# EAGLE design NailUV 2x5x3 (EAGLE 8.1.1)
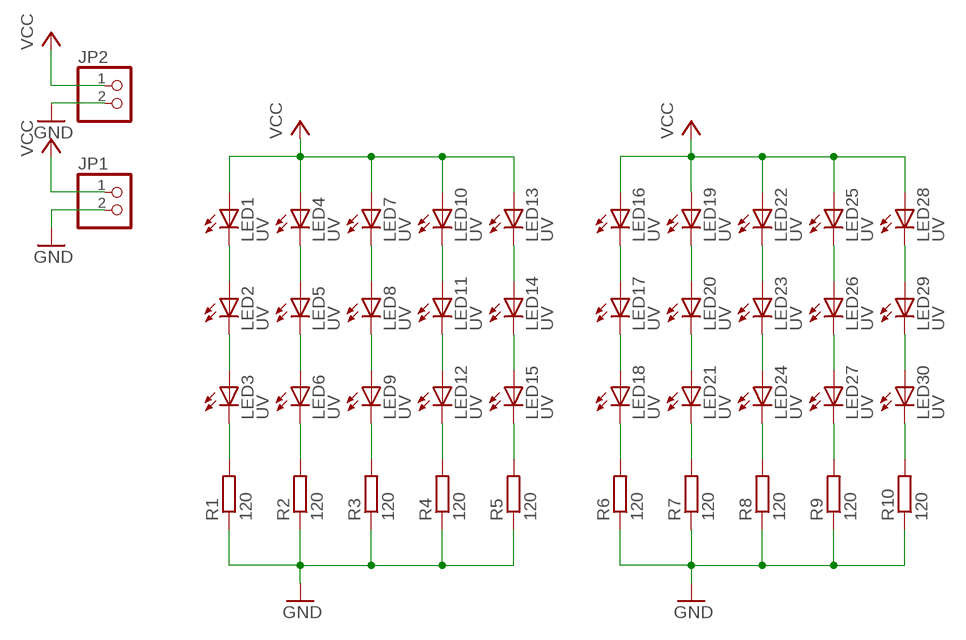
[diagram p0: schematic, sheet 1]

## Parts
JP1  PINHD-1X2  [1X02]
JP2  PINHD-1X2  [1X02]
LED1  UV  LED5MM  [LED5MM]
LED2  UV  LED5MM  [LED5MM]
LED3  UV  LED5MM  [LED5MM]
LED4  UV  LED5MM  [LED5MM]
LED5  UV  LED5MM  [LED5MM]
LED6  UV  LED5MM  [LED5MM]
LED7  UV  LED5MM  [LED5MM]
LED8  UV  LED5MM  [LED5MM]
LED9  UV  LED5MM  [LED5MM]
LED10  UV  LED5MM  [LED5MM]
LED11  UV  LED5MM  [LED5MM]
LED12  UV  LED5MM  [LED5MM]
LED13  UV  LED5MM  [LED5MM]
LED14  UV  LED5MM  [LED5MM]
LED15  UV  LED5MM  [LED5MM]
LED16  UV  LED5MM  [LED5MM]
LED17  UV  LED5MM  [LED5MM]
LED18  UV  LED5MM  [LED5MM]
LED19  UV  LED5MM  [LED5MM]
LED20  UV  LED5MM  [LED5MM]
LED21  UV  LED5MM  [LED5MM]
LED22  UV  LED5MM  [LED5MM]
LED23  UV  LED5MM  [LED5MM]
LED24  UV  LED5MM  [LED5MM]
LED25  UV  LED5MM  [LED5MM]
LED26  UV  LED5MM  [LED5MM]
LED27  UV  LED5MM  [LED5MM]
LED28  UV  LED5MM  [LED5MM]
LED29  UV  LED5MM  [LED5MM]
LED30  UV  LED5MM  [LED5MM]
R1  120  R-EU_0207/10  [0207/10]
R2  120  R-EU_0207/10  [0207/10]
R3  120  R-EU_0207/10  [0207/10]
R4  120  R-EU_0207/10  [0207/10]
R5  120  R-EU_0207/10  [0207/10]
R6  120  R-EU_0207/10  [0207/10]
R7  120  R-EU_0207/10  [0207/10]
R8  120  R-EU_0207/10  [0207/10]
R9  120  R-EU_0207/10  [0207/10]
R10  120  R-EU_0207/10  [0207/10]

## Nets
GND: JP1.2 JP2.2 R1.1 R2.1 R3.1 R4.1 R5.1 R6.1 R7.1 R8.1 R9.1 R10.1
N$1: LED1.K(C) LED2.A
N$2: LED4.K(C) LED5.A
N$3: LED7.K(C) LED8.A
N$4: LED2.K(C) LED3.A
N$5: LED5.K(C) LED6.A
N$6: LED8.K(C) LED9.A
N$7: LED3.K(C) R1.2
N$8: LED6.K(C) R2.2
N$9: LED9.K(C) R3.2
N$10: LED13.K(C) LED14.A
N$11: LED10.K(C) LED11.A
N$12: LED11.K(C) LED12.A
N$13: LED14.K(C) LED15.A
N$14: LED15.K(C) R5.2
N$15: LED12.K(C) R4.2
N$16: LED16.K(C) LED17.A
N$17: LED19.K(C) LED20.A
N$18: LED22.K(C) LED23.A
N$19: LED17.K(C) LED18.A
N$20: LED20.K(C) LED21.A
N$21: LED23.K(C) LED24.A
N$22: LED18.K(C) R6.2
N$23: LED21.K(C) R7.2
N$24: LED24.K(C) R8.2
N$25: LED28.K(C) LED29.A
N$26: LED25.K(C) LED26.A
N$27: LED26.K(C) LED27.A
N$28: LED29.K(C) LED30.A
N$29: LED30.K(C) R10.2
N$30: LED27.K(C) R9.2
VCC: JP1.1 JP2.1 LED1.A LED4.A LED7.A LED10.A LED13.A LED16.A LED19.A LED22.A LED25.A LED28.A

## Library data of the parts
JP1 JP2 = pinhead:PINHD-1X2: PIN HEADER
LED1-LED30 = led:LED: LED OSRAM: - CHIPLED LG R971, LG N971, LY N971, LG Q971, LY Q971, LO R971, LY R971 LH N974, LH R974 LS Q976, LO Q976, LY Q976 LO Q996 - Hyper CHIPLED LW Q18S LB Q993, LB Q99A, LB R99A - SideLED LS A670, LO A670, LY A670, LG A670, LP A670 LB A673, LV A673, LT A673, LW A673 LH A674 LY A675 LS A676, LA A676, LO A676, LY A676, LW A676 LS A679, LY A679, LG A679 - Hyper Micro SIDELED® LS Y876, LA Y876, LO Y876, LY Y876 LT Y87S - SmartLED LW L88C, LW L88S LB L89C, LB L89S, LG L890 LS L89K, LO L89K, LY L89K LS L896, LA L896, LO L896, LY L896 - TOPLED LS T670, LO T670, LY T670, LG T670, LP T670 LSG T670, LSP T670, LSY T670, LOP T670, LYG T670 LG T671, LOG T671, LSG T671 LB T673, LV T673, LT T673, LW T673 LH T674 LS T676, LA T676, LO T676, LY T676, LB T676, LH T676, LSB T676, LW T676 LB T67C, LV T67C, LT T67C, LS T67K, LO T67K, LY T67K, LW E67C LS E67B, LA E67B, LO E67B, LY E67B, LB E67C, LV E67C, LT E67C LW T67C LS T679, LY T679, LG T679 LS T770, LO T770, LY T770, LG T770, LP T770 LB T773, LV T773, LT T773, LW T773 LH T774 LS E675, LA E675, LY E675, LS T675 LS T776, LA T776, LO T776, LY T776, LB T776 LHGB T686 LT T68C, LB T68C - Hyper Mini TOPLED® LB M676 - Mini TOPLED Santana® LG M470 LS M47K, LO M47K, LY M47K Source: http://www.osram.convergy.de LUXEON: - LUMILED® LXK2-PW12-R00, LXK2-PW12-S00, LXK2-PW14-U00, LXK2-PW14-V00 LXK2-PM12-R00, LXK2-PM12-S00, LXK2-PM14-U00 LXK2-PE12-Q00, LXK2-PE12-R00, LXK2-PE12-S00, LXK2-PE14-T00, LXK2-PE14-U00 LXK2-PB12-K00, LXK2-PB12-L00, LXK2-PB12-M00, LXK2-PB14-N00, LXK2-PB14-P00, LXK2-PB14-Q00 LXK2-PR12-L00, LXK2-PR12-M00, LXK2-PR14-Q00, LXK2-PR14-R00 LXK2-PD12-Q00, LXK2-PD12-R00, LXK2-PD12-S00 LXK2-PH12-R00, LXK2-PH12-S00 LXK2-PL12-P00, LXK2-PL12-Q00, LXK2-PL12-R00 Source: www.luxeon.com KINGBRIGHT: KA-3528ASYC Source: www.kingbright.com
R1-R10 = resistor:R-EU_: RESISTOR, European symbol

## Board
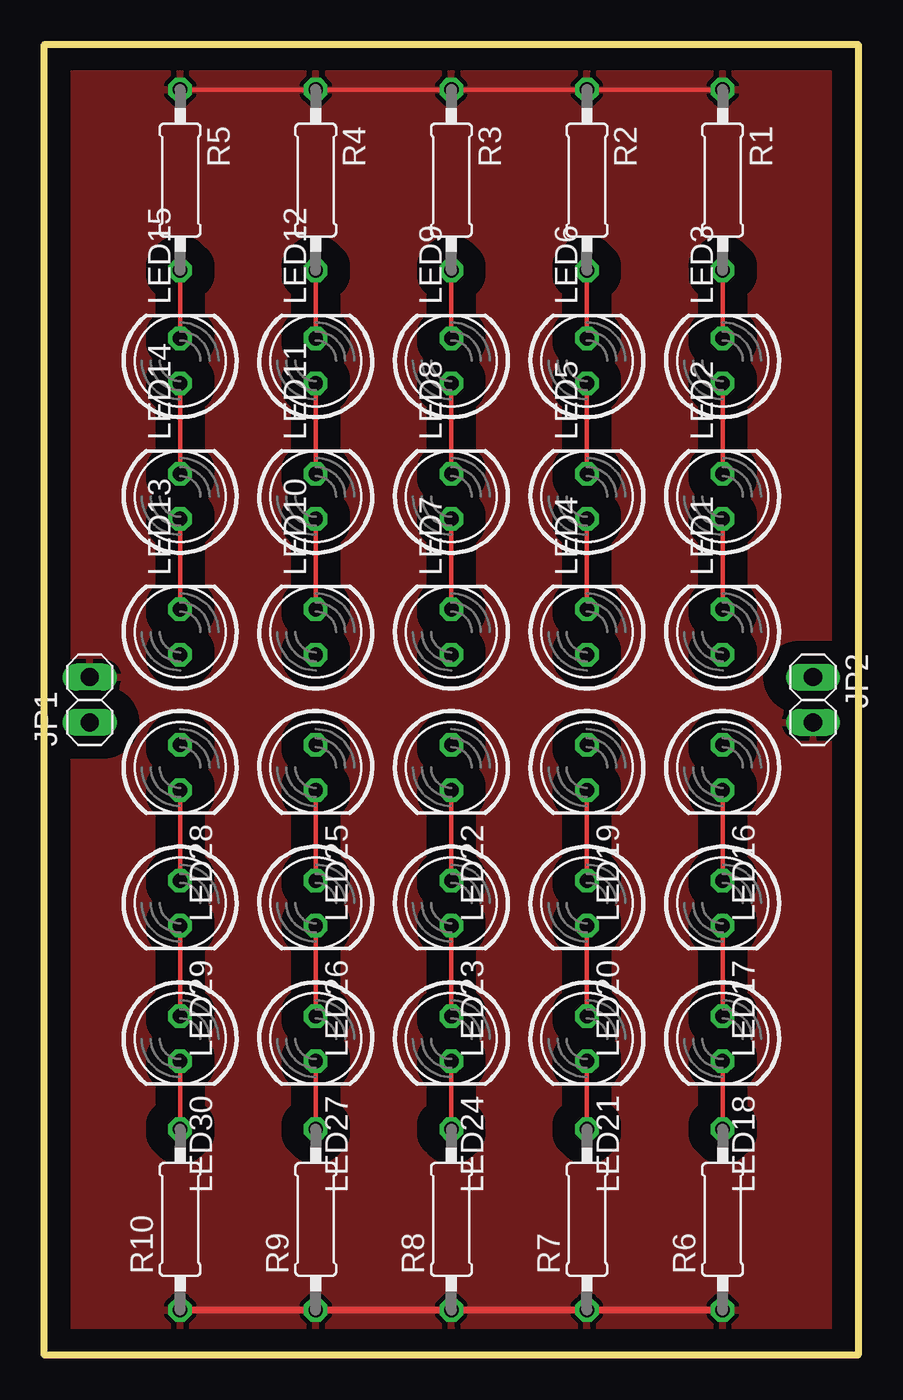
[diagram p1: board, top side]
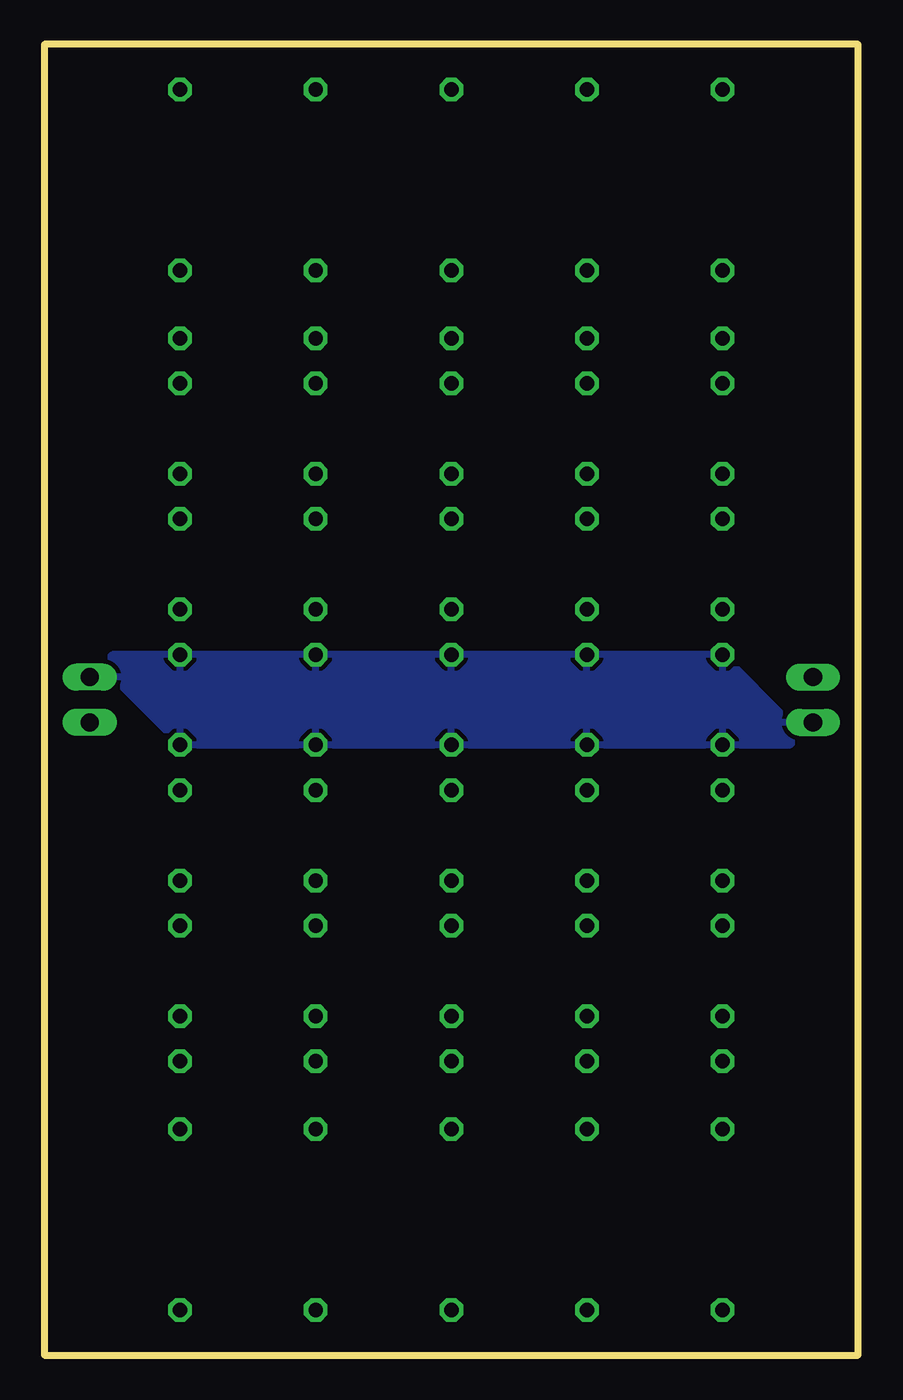
[diagram p2: board, bottom side, seen from below]

Size 45.72 x 73.66 mm. Coordinates in mm from the lower left corner, seen from the top.
Outline: 0,73.66 45.72,73.66 45.72,0 0,0 0,73.66
Copper layers (1*16): Top 0.035mm / dielectric 1.5mm / Bottom 0.035mm
Design rules "SeeedStudio_2layer_DRU_no_angle_20140221": minimum track width 6mil, minimum drill 12mil, track to track 6mil, track to pad 6mil, pad to pad 6mil, via to via 6mil, smd to smd 0mil, copper to edge 10mil, drill to drill 10mil, minimum pad ring 10mil, minimum via ring 6mil, stop-mask expansion 2mil, vias tented up to drill 100mil, thermal gap 10mil

### Footprints (pad centres in the part's own frame; a part is rotated, then mirrored left to right if it is on the bottom)
1X02 = drill 1.016 long: 1 -1.27,0; 2 1.27,0
LED5MM = drill 0.813 octagon: A -1.27,0; K 1.27,0
0207/10 = drill 0.813 octagon: 1 -5.08,0; 2 5.08,0

### Placement (x,y rotation side)
JP1  2.54,36.83 90 top
JP2  43.18,36.83 270 top
LED1  38.1,40.64 90 top
LED2  38.1,48.26 90 top
LED3  38.1,55.88 90 top
LED4  30.48,40.64 90 top
LED5  30.48,48.26 90 top
LED6  30.48,55.88 90 top
LED7  22.86,40.64 90 top
LED8  22.86,48.26 90 top
LED9  22.86,55.88 90 top
LED10  15.24,40.64 90 top
LED11  15.24,48.26 90 top
LED12  15.24,55.88 90 top
LED13  7.62,40.64 90 top
LED14  7.62,48.26 90 top
LED15  7.62,55.88 90 top
LED16  38.1,33.02 270 top
LED17  38.1,25.4 270 top
LED18  38.1,17.78 270 top
LED19  30.48,33.02 270 top
LED20  30.48,25.4 270 top
LED21  30.48,17.78 270 top
LED22  22.86,33.02 270 top
LED23  22.86,25.4 270 top
LED24  22.86,17.78 270 top
LED25  15.24,33.02 270 top
LED26  15.24,25.4 270 top
LED27  15.24,17.78 270 top
LED28  7.62,33.02 270 top
LED29  7.62,25.4 270 top
LED30  7.62,17.78 270 top
R1  38.1,66.04 270 top
R2  30.48,66.04 270 top
R3  22.86,66.04 270 top
R4  15.24,66.04 270 top
R5  7.62,66.04 270 top
R6  38.1,7.62 90 top
R7  30.48,7.62 90 top
R8  22.86,7.62 90 top
R9  15.24,7.62 90 top
R10  7.62,7.62 90 top

### Tracks (layer width: path | path; a pad name or v marks a point on that pad's centre or on a via)
GND
  Top 0.254: R1.1 R5.1
  Top 0.406: R10.1 R6.1
  pour Top (isolate 1.27): 0,73.66 45.72,73.66 45.72,0 0,0
N$1
  Top 0.254: LED1.K LED2.A
N$2
  Top 0.254: LED5.A LED4.K
N$3
  Top 0.254: LED7.K LED8.A
N$4
  Top 0.254: LED2.K LED3.A
N$5
  Top 0.254: LED6.A LED5.K
N$6
  Top 0.254: LED8.K LED9.A
N$7
  Top 0.254: LED3.K R1.2
N$8
  Top 0.254: R2.2 LED6.K
N$9
  Top 0.254: LED9.K R3.2
N$10
  Top 0.254: LED13.K LED14.A
N$11
  Top 0.254: LED11.A LED10.K
N$12
  Top 0.254: LED12.A LED11.K
N$13
  Top 0.254: LED14.K LED15.A
N$14
  Top 0.254: LED15.K R5.2
N$15
  Top 0.254: R4.2 LED12.K
N$16
  Top 0.254: LED16.K LED17.A
N$17
  Top 0.254: LED19.K LED20.A
N$18
  Top 0.254: LED22.K LED23.A
N$19
  Top 0.254: LED17.K LED18.A
N$20
  Top 0.254: LED20.K LED21.A
N$21
  Top 0.254: LED23.K LED24.A
N$22
  Top 0.254: LED18.K R6.2
N$23
  Top 0.254: LED21.K R7.2
N$24
  Top 0.254: LED24.K R8.2
N$25
  Top 0.254: LED28.K LED29.A
N$26
  Top 0.254: LED25.K LED26.A
N$27
  Top 0.254: LED26.K LED27.A
N$28
  Top 0.254: LED29.K LED30.A
N$29
  Top 0.254: LED30.K R10.2
N$30
  Top 0.254: LED27.K R9.2
VCC
  pour Bottom (isolate 0.305): 2.54,35.56 3.81,35.56 7.62,39.37 15.24,39.37 22.86,39.37 30.48,39.37 38.1,39.37 41.91,39.37 43.18,38.1 41.91,38.1 38.1,34.29 30.48,34.29 22.86,34.29 15.24,34.29 7.62,34.29 3.81,34.29